# EAGLE schematic x9c (EAGLE 9.6.2)
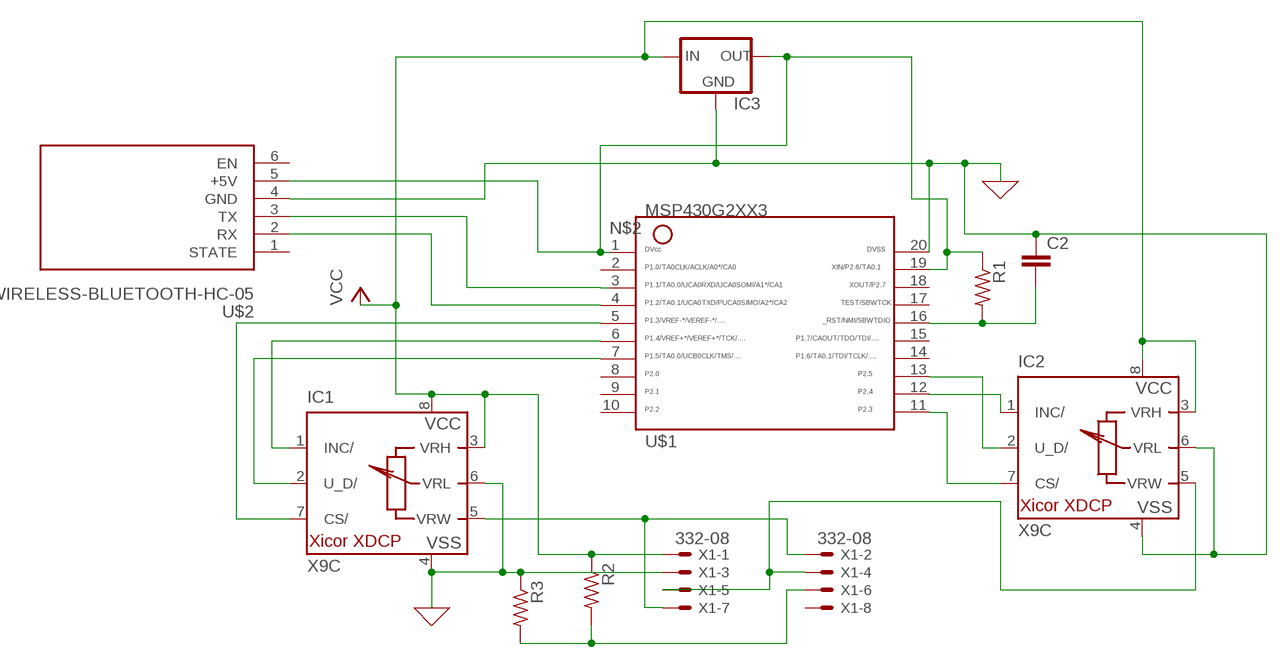
[diagram p0: schematic, sheet 1]

## Parts
C2  C2,5-3  [C2.5-3]
IC1  X9C  [DIL08]
IC2  X9C  [DIL08]
IC3  78MXXL  [78MXXL]
R1  R-US_0204/5  [0204/5]
R2  R-US_0204/5  [0204/5]
R3  R-US_0204/5  [0204/5]
U$1  G2XX3---N20  [N20]
U$2  WIRELESS-BLUETOOTH-HC-05  [WIRELESS-BLUETOOTH-HC-05]
X1  332-08  [332-08]

## Nets
0: C2.1 IC1.4(VSS) IC1.6(VRL) IC2.4(VSS) IC2.6(VRL) IC3.GND R3.1 U$1.20 U$2.4(GND) X1.3 ; supply symbol labelled GND
N$1: U$1.4 U$2.2(RX)
N$2: IC3.OUT R1.1 U$1.1 U$1.19 U$2.5(+5V)
N$3: U$1.3 U$2.3(TX)
N$4: IC1.7(CS/) U$1.5
N$5: IC1.1(INC/) U$1.6
N$6: IC1.2(U_D/) U$1.7
N$7: C2.2 R1.2 U$1.16
N$8: IC2.7(CS/) U$1.11
N$9: IC2.1(INC/) U$1.12
N$10: IC2.2(U_D/) U$1.13
N$13: IC1.5(VRW) X1.2 X1.7
N$14: IC2.5(VRW) X1.4 X1.5
N$16: R2.2 R3.2 X1.6
VCC: IC1.3(VRH) IC1.8(VCC) IC2.3(VRH) IC2.8(VCC) IC3.IN R2.1 X1.1
Unconnected: U$1.2 U$1.8 U$1.9 U$1.10 U$1.14 U$1.15 U$1.17 U$1.18 U$2.1(STATE) U$2.6(EN) X1.8

## Library data of the parts
C2 = capacitor-wima:C: CAPACITOR naming: grid - package width
IC1 IC2 = xicor-eepot:X9C*: Xicor Digitally controlled Potentiometer (EEPOT) by Xicor (now at www.intersil.com)
IC3 = v-reg:78MXXL: VOLTAGE REGULATOR
R1-R3 = rcl:R-US_: RESISTOR, American symbol; SPICEPREFIX: R
U$1 = TI_MSP430_v16:G2XX3---N20: MSP430G2XX1 PDIP (N) 20 Pin Package
U$2 = diy-modules:WIRELESS-BLUETOOTH-HC-05: Bluetooth Transceiver Module based on HC-05 board Tutorial is available here: https://arduino-info.wikispaces.com/BlueTooth-HC05-HC06-Modules-How-To Click here to find device on ebay.com <http://www.ebay.com/sch/hc-05+module+rs232>
X1 = con-garry:332-08: 8 Pin - 2mm Dual Row Source: www.mpe-connector.de / garry_shortform_2012.pdf